# EAGLE design ICS40300-preamp-surfacemount_Rev-A (EAGLE 8.0.0)
COMPANY: ADAFRUIT INDUSTRIES; DRAWN: KTOWN; REV: A
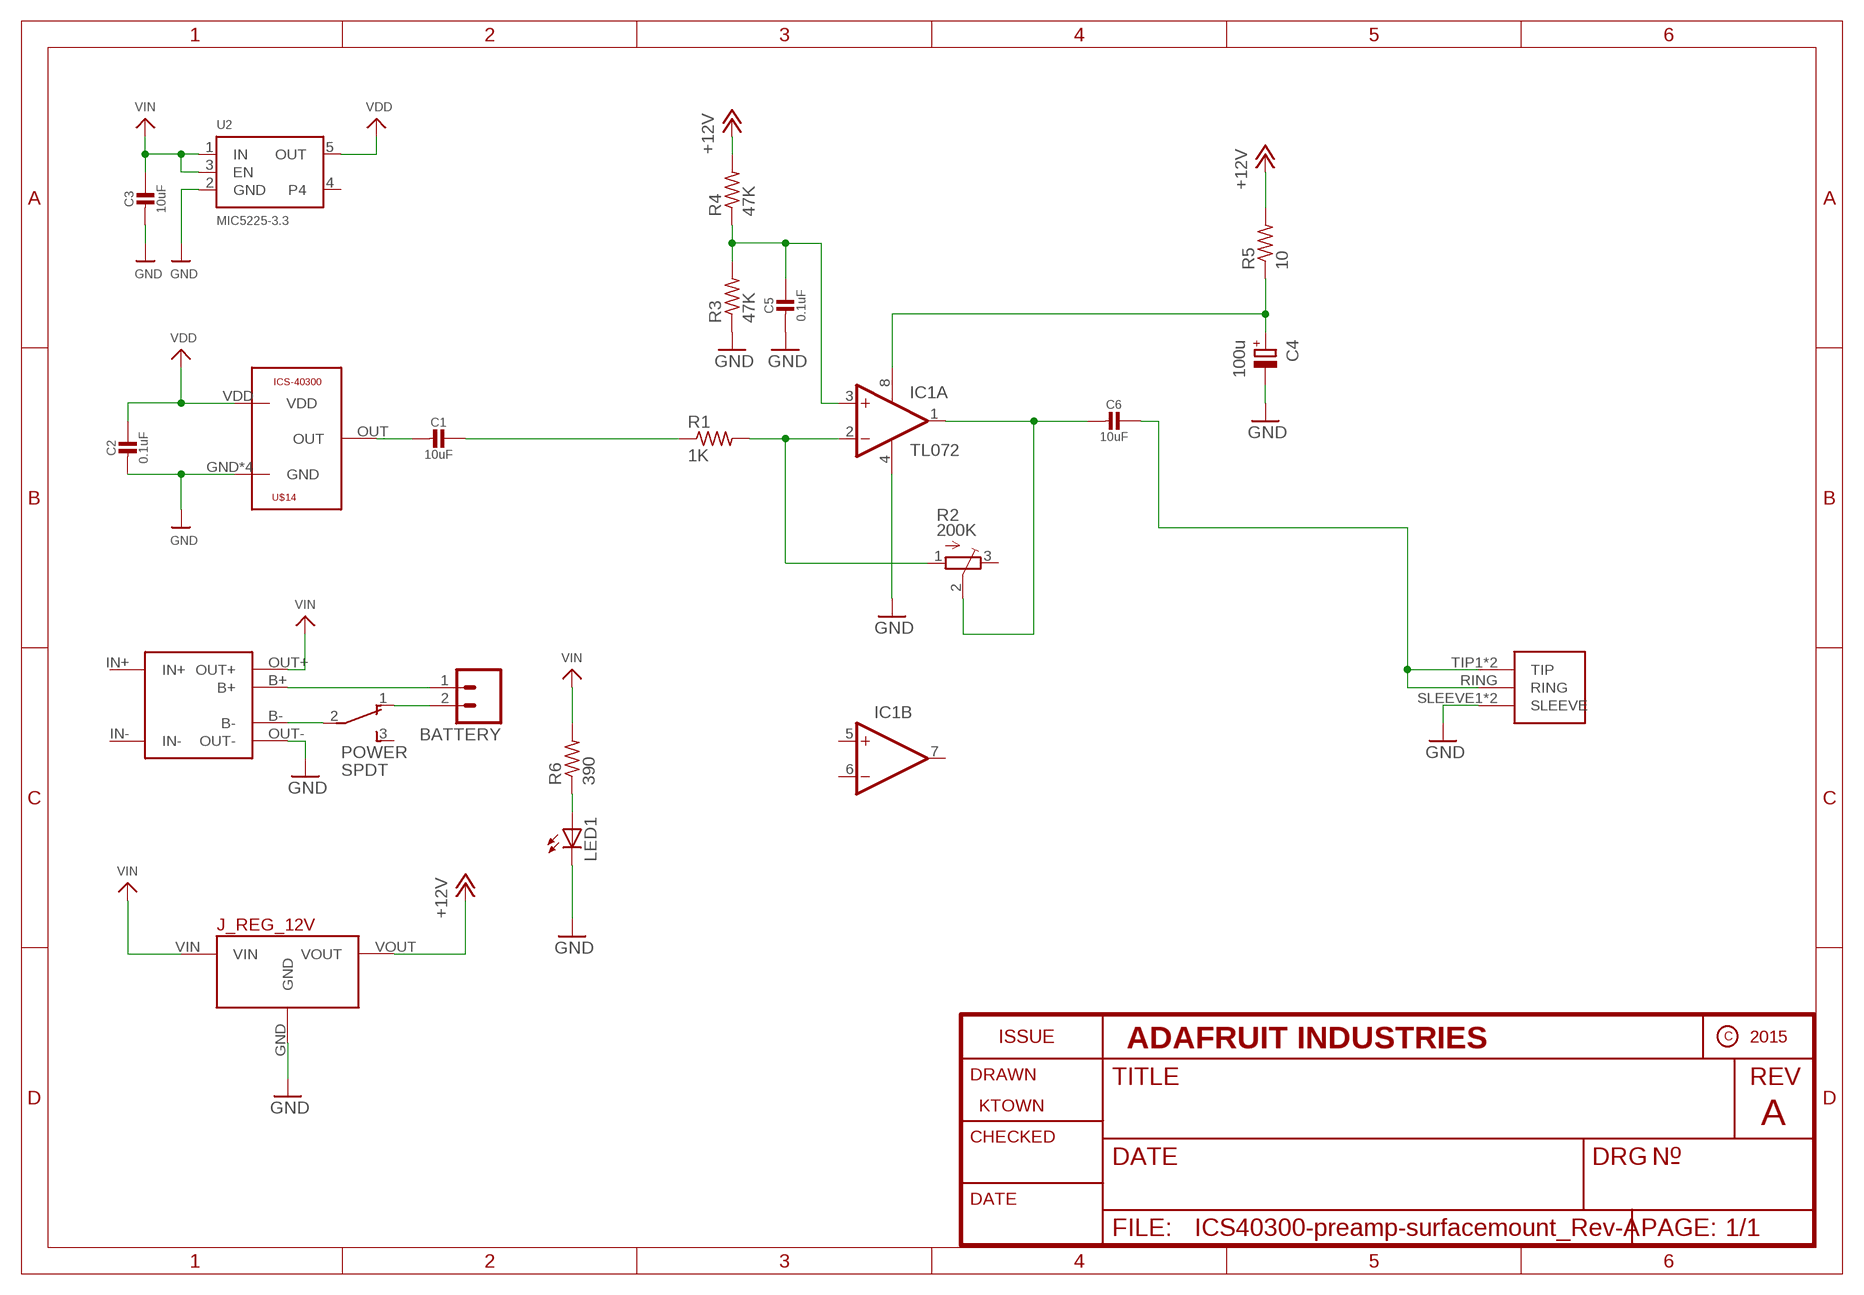
[diagram p0: schematic, sheet 1]

## Parts
BATTERY  M02LOCK  [1X02_LOCK]
C1  10uF  CAP_CERAMIC0805-NOOUTLINE  [0805-NO]
C2  0.1uF  CAP_CERAMIC0805-NOOUTLINE  [0805-NO]
C3  10uF  CAP_CERAMIC0805-NOOUTLINE  [0805-NO]
C4  100u  CPOL-EUTT2D4L  [TT2D4L]
C5  0.1uF  CAP_CERAMIC0805-NOOUTLINE  [0805-NO]
C6  10uF  CAP_CERAMIC0805-NOOUTLINE  [0805-NO]
IC1  TL072  OPA2134UA  [SO08]
J_REG_12V  POLOLU_VOLTAGE_REGULATORS_3PIN  [POLOLU_5V-12V_STEPUP_U3V12F5-U3V12F12]
LED1  LED3MM  [LED3MM]
POWER  SPDT  SWITCH_SPDTTE-CONNECT  [SWITCH_SPDT-TE-CONNECT]
R1  1K  R-US_R0805  [R0805]
R2  200K  TRIMPOT3386  [TRIM-3386]
R3  47K  R-US_R0805  [R0805]
R4  47K  R-US_R0805  [R0805]
R5  10  R-US_R0805  [R0805]
R6  390  R-US_R0805  [R0805]
U2  MIC5225-3.3  VREG_SOT23-5  [SOT23-5]
U$13  1/8"-F-STEREO-PCB  [1/8"-F-STEREO-PCB]
U$14  ICS-40300  [ICS-40300]
USB-LIPO-CHARGER  TP4056-MODULE  [TP4056-LITHIUM-PROTECTED-MODULE]

## Nets
+12V: J_REG_12V.VOUT R4.2 R5.2
GND: C2.2 C3.2 C4.- C5.2 IC1.4(A:V-) J_REG_12V.GND LED1.K(C) R3.1 U2.2(GND) U$13.SLEEVE1(SLEEVE) U$13.SLEEVE2(SLEEVE) U$14.GND U$14.GND1(GND) U$14.GND2(GND) U$14.GND3(GND) USB-LIPO-CHARGER.OUT-
N$1: C1.2 U$14.OUT
N$2: C1.1 R1.1
N$4: C4.+ IC1.8(A:V+) R5.1
N$5: IC1.2(A:-IN) R1.2 R2.1(A)
N$7: C6.1 U$13.RING U$13.TIP1(TIP) U$13.TIP2(TIP)
N$8: C5.1 IC1.3(A:+IN) R3.2 R4.1
N$9: C6.2 IC1.1(A:OUT) R2.2(S)
N$11: BATTERY.2 POWER.1
N$16: LED1.A R6.1
N$18: BATTERY.1 USB-LIPO-CHARGER.B+
N$19: POWER.2 USB-LIPO-CHARGER.B-
VDD: C2.1 U2.5(OUT) U$14.VDD
VIN: C3.1 J_REG_12V.VIN R6.2 U2.1(IN) U2.3(EN) USB-LIPO-CHARGER.OUT+
Unconnected: IC1.5(B:+IN) IC1.6(B:-IN) IC1.7(B:OUT) POWER.3 R2.3(E) U2.4

## Power pins joined to a net without a drawn wire
IN+: USB-LIPO-CHARGER.IN+
IN-: USB-LIPO-CHARGER.IN-

## Library data of the parts
BATTERY = CMU-ArtFab:M02: Header 2 Standard 2-pin 0.1" header. Use with straight break away headers (SKU : PRT-00116), right angle break away headers (PRT-00553), swiss pins (PRT-00743), machine pins (PRT-00117), and female headers (PRT-00115). Molex polarized connector foot print use with SKU : PRT-08233 with associated crimp pins and housings.
C1-C3 C5 C6 = microbuilder:CAP_CERAMIC: Ceramic Capacitors For new designs, use the packages preceded by an '_' character since they are more reliable: The following footprints should be used on most boards: _0402 - Standard footprint for regular board layouts _0603 - Standard footprint for regular board layouts _0805 - Standard footprint for regular board layouts _1206 - Standard footprint for regular board layouts For extremely tight-pitch boards where space is at a premium, the following 'micro-pitch' footprints can be used (smaller pads, no silkscreen outline, etc.): _0402MP - Micro-pitch footprint for very dense/compact boards _0603MP - Micro-pitch footprint for very dense/compact boards _0805MP - Micro-pitch footprint for very dense/compact boards _1206MP - Micro-pitch footprint for very dense/compact boards
C4 = rcl:CPOL-EU: POLARIZED CAPACITOR, European symbol
IC1 = linear:OPA2*: Dual Operational Amplifier Low Power, Single-Supply, Rail-To-Rail Operational Amplifier Source: http://focus.ti.com/lit/ds/symlink/opa2345.pdf http://focus.ti.com .. opa241.pdf http://focus.ti.com/lit/ds/symlink/opa2134.pdf; IC_NAME: TL072
J_REG_12V = CMU-ArtFab:POLOLU_VOLTAGE_REGULATORS_3PIN: Polulu 5V Step-Up/Step-Down Voltage REgulator S7V7F5
LED1 = led:LED: LED OSRAM: - CHIPLED LG R971, LG N971, LY N971, LG Q971, LY Q971, LO R971, LY R971 LH N974, LH R974 LS Q976, LO Q976, LY Q976 LO Q996 - Hyper CHIPLED LW Q18S LB Q993, LB Q99A, LB R99A - SideLED LS A670, LO A670, LY A670, LG A670, LP A670 LB A673, LV A673, LT A673, LW A673 LH A674 LY A675 LS A676, LA A676, LO A676, LY A676, LW A676 LS A679, LY A679, LG A679 - Hyper Micro SIDELED® LS Y876, LA Y876, LO Y876, LY Y876 LT Y87S - SmartLED LW L88C, LW L88S LB L89C, LB L89S, LG L890 LS L89K, LO L89K, LY L89K LS L896, LA L896, LO L896, LY L896 - TOPLED LS T670, LO T670, LY T670, LG T670, LP T670 LSG T670, LSP T670, LSY T670, LOP T670, LYG T670 LG T671, LOG T671, LSG T671 LB T673, LV T673, LT T673, LW T673 LH T674 LS T676, LA T676, LO T676, LY T676, LB T676, LH T676, LSB T676, LW T676 LB T67C, LV T67C, LT T67C, LS T67K, LO T67K, LY T67K, LW E67C LS E67B, LA E67B, LO E67B, LY E67B, LB E67C, LV E67C, LT E67C LW T67C LS T679, LY T679, LG T679 LS T770, LO T770, LY T770, LG T770, LP T770 LB T773, LV T773, LT T773, LW T773 LH T774 LS E675, LA E675, LY E675, LS T675 LS T776, LA T776, LO T776, LY T776, LB T776 LHGB T686 LT T68C, LB T68C - Hyper Mini TOPLED® LB M676 - Mini TOPLED Santana® LG M470 LS M47K, LO M47K, LY M47K Source: http://www.osram.convergy.de LUXEON: - LUMILED® LXK2-PW12-R00, LXK2-PW12-S00, LXK2-PW14-U00, LXK2-PW14-V00 LXK2-PM12-R00, LXK2-PM12-S00, LXK2-PM14-U00 LXK2-PE12-Q00, LXK2-PE12-R00, LXK2-PE12-S00, LXK2-PE14-T00, LXK2-PE14-U00 LXK2-PB12-K00, LXK2-PB12-L00, LXK2-PB12-M00, LXK2-PB14-N00, LXK2-PB14-P00, LXK2-PB14-Q00 LXK2-PR12-L00, LXK2-PR12-M00, LXK2-PR14-Q00, LXK2-PR14-R00 LXK2-PD12-Q00, LXK2-PD12-R00, LXK2-PD12-S00 LXK2-PH12-R00, LXK2-PH12-S00 LXK2-PL12-P00, LXK2-PL12-Q00, LXK2-PL12-R00 Source: www.luxeon.com KINGBRIGHT: KA-3528ASYC Source: www.kingbright.com
POWER = CMU-ArtFab:SWITCH_SPDT
R1 R3-R6 = CMU-ArtFab:R-US_: RESISTOR, American symbol
R2 = adafruit:TRIMPOT: SMT trimmer potentiometer part number TC33X http://www.ladyada.net/library/eagle
U2 = microbuilder:VREG_SOT23-5: SOT23-5 Fixed Voltage Regulators Part Current Out V Out V In V Dropout θJA (°C/W) TJ (°C) Digikey Part No. ADP121 150mA 3.3V 3.4-5.5V 0.09V @ 150mA -- -- ADP121-AUJZ33R7CT-ND ADP121 150mA 3.0V 3.1-5.5V 0.09V @ 150mA -- -- ADP121-AUJZ30R7CT-ND ADP122 300mA 3.3V 3.4-5.5V 0.085V @ 300mA -- -- ADP122AUJZ-3.3-R7CT-ND ADP1712 300mA 3.3V 3.5-5.5V 0.17V @ 300mA -- -- ADP1712AUJZ-3.3-R7TR-ND AP7311 (Low Cost) 150mA 3.3V 3.5-6V 0.15V @ 150mA -- -- AP7311-33WG-7DICT-ND LD39015M18R 150mA 1.8V 1.9V-5.5V 0.08V @ 100mA -- -- 497-6977-1-ND LP2985A-33DBVR 150mA 3.3V 3.3-16V 0.28V @ 150mA 206 150 296-18479-1-ND MCP1824T-3302E/OT 300mA 3.3V 3.5V-6V 0.2V @ 300mA -- -- MCP1824T-3302E/OTCT-ND MIC5205-2.5YM5 TR 150mA 2.5V 2.7-16V 0.165V @ 150mA -- -- 576-1257-2-ND MIC5205-3.0YM5 TR 150mA 3.0V 3.2V-16V 0.165V @ 150mA -- -- 576-1258-2-ND MIC5205-3.3YM5 TR 150mA 3.3V 3.5V-16V 0.165V @ 150mA -- -- 576-1259-2-ND TPS780330220 150mA 3.3V+2.2V 3.6-5.5V 250mV Max -- -- 296-23332-1-ND TDA3663/N1,135 100mA 3.3V 3.5-45V 0.18V @ 50mA -- -- 568-5343-1-ND Max operating temp can be calculated using θJA, TJ (max junction temperature), and power in watts. Set the "Maximum Ambient Temperature" until it reaches TJ ("Max Junction Temperature"), which is the absolute limit for safe use of the regulator: Heat Sink Temperature Calculator <http://www.daycounter.com/Calculators/Heat-Sink-Temperature-Calculator.phtml> For example, With 12V source into a 3.3V LP2985 and a 30mA load, we are dissipating (12V-3.3V) * 0.03A = 0.261W. With a θJA of 206 °C/W, a TJ of 150°C, and 261mW we can safely use the chip without a heat sink up to 75°C (=147.1°C Junction Temperature).
U$13 = CMU-ArtFab:1/8"-F-STEREO-PCB
U$14 = CMU-ArtFab:ICS-40300
USB-LIPO-CHARGER = CMU-ArtFab:TP4056-MODULE

## Board
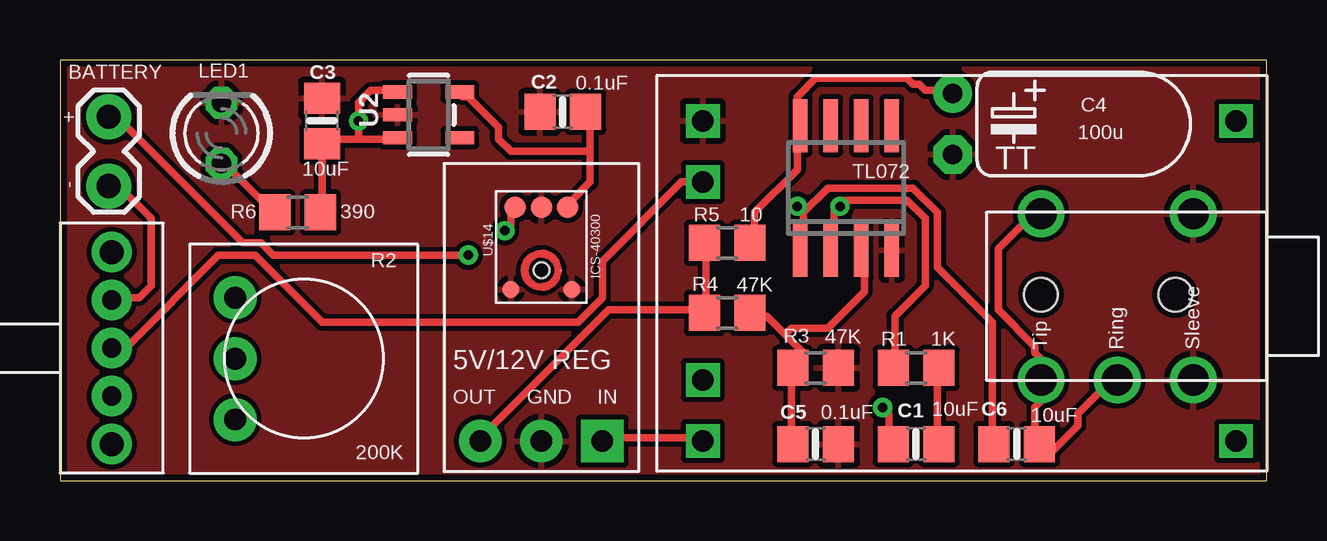
[diagram p1: board, top side]
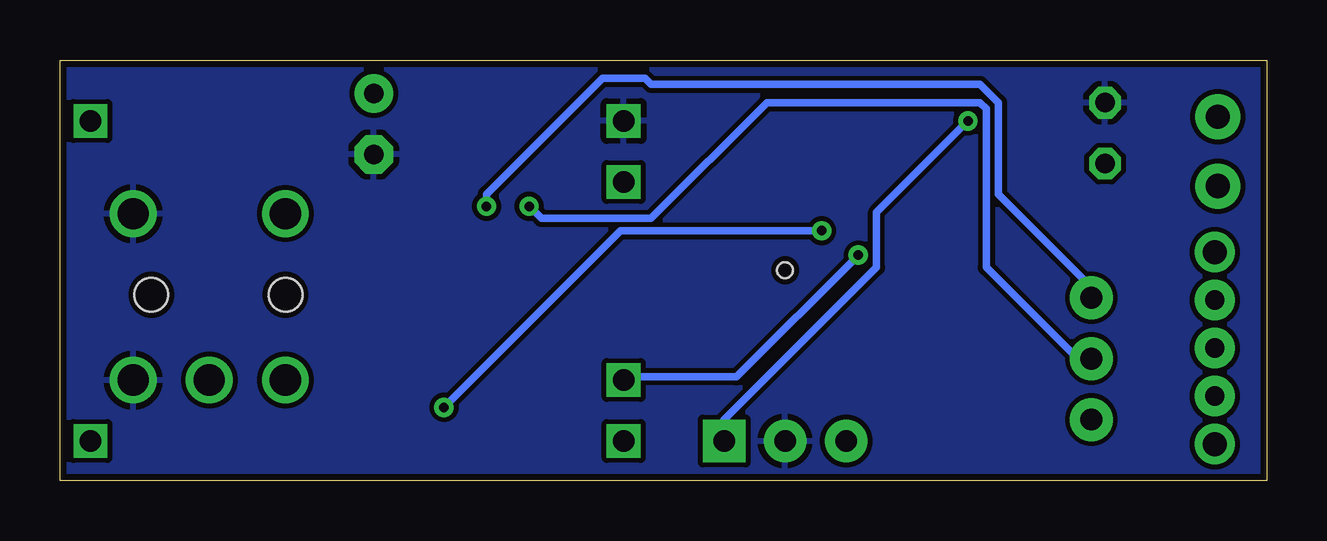
[diagram p2: board, bottom side, seen from below]

Size 50.29 x 17.53 mm. Coordinates in mm from the lower left corner, seen from the top.
Outline: 0,0 50.29,0 50.29,17.53 0,17.53 0,0
Copper layers (1*16): Top 0.035mm / dielectric 1.5mm / Bottom 0.035mm
Design rules "adafruit *": minimum track width 12mil, minimum drill 15.5mil, track to track 8mil, track to pad 8mil, pad to pad 8mil, via to via 8mil, smd to smd 8mil, copper to edge 10mil, drill to drill 8mil, minimum pad ring 10mil, minimum via ring 8mil, stop-mask expansion 2mil, vias tented up to drill 20mil, thermal gap 10mil

### Footprints (pad centres in the part's own frame; a part is rotated, then mirrored left to right if it is on the bottom)
1X02_LOCK = drill 1.016 pad 1.88: 1 -0.178,0; 2 2.718,0
0805-NO = smd 1.3 x 1.5: 1 -0.95,0; 2 0.95,0
TT2D4L = drill 0.813 pad 1.6: + -1.27,0 | drill 0.813 pad 1.6 octagon: - 1.27,0
SO08 = smd 0.6 x 2.2: 1 -1.905,-2.6; 2 -0.635,-2.6; 3 0.635,-2.6; 4 1.905,-2.6; 5 1.905,2.6; 6 0.635,2.6; 7 -0.635,2.6; 8 -1.905,2.6
POLOLU_5V-12V_STEPUP_U3V12F5-U3V12F12 = drill 0.9 pad 1.778: GND 0,-6.35; VOUT -2.54,-6.35 | drill 0.9 pad 1.778 square: VIN 2.54,-6.35
LED3MM = drill 0.813 octagon: A -1.27,0; K 1.27,0
SWITCH_SPDT-TE-CONNECT = drill 0.8 pad 1.676: 1 2,0; 2 4,0; 3 6,0 | drill 1 pad 1.676: MOUNT1 0,0; MOUNT2 8,0
R0805 = smd 1.3 x 1.5: 1 -0.95,0; 2 0.95,0
TRIM-3386 = drill 0.9 pad 1.778: 1 -2.54,-2.857; 2 0,-2.857; 3 2.54,-2.857
SOT23-5 = smd 0.55 x 1.2: 1 -0.95,-1.3; 2 0,-1.3; 3 0.95,-1.3; 4 0.95,1.3; 5 -0.95,1.3
1/8"-F-STEREO-PCB = drill 1.3: RING 5.461,0; SLEEVE1 8.636,6.934; SLEEVE2 8.636,0; TIP1 2.286,6.934; TIP2 2.286,0 | hole 1.4: 2.286,3.556; 7.874,3.556
ICS-40300 = smd 0.9 x 0.9: GND -2.62,0; OUT -2.62,-1.1; VDD -2.62,1.1 | smd 0.7 x 0.7: GND1 0.79,1.27; GND2 0.79,-1.27 | smd 0.1 x 0.1: GND3 0,0.82 | hole 0.65: 0,0
TP4056-LITHIUM-PROTECTED-MODULE = drill 0.9 square: B+ 10.795,4.445; B- 10.795,-3.81; IN+ -11.43,6.985; IN- -11.43,-6.35; OUT+ 10.795,6.985; OUT- 10.795,-6.35

### Placement (x,y rotation side)
BATTERY  2.03,14.99 270 top
C1  35.69,1.52 180 top
C2  20.95,15.37 180 top
C3  10.92,14.99 90 top
C4  37.21,14.86 270 top
C5  31.5,1.52 0 top
C6  39.88,1.52 180 top
IC1  32.77,12.19 0 top
J_REG_12V  20.07,8 0 top
LED1  6.73,14.48 90 top
POWER  2.16,9.53 270 top
R1  35.69,4.7 180 top
R2  10.16,5.08 270 top
R3  31.5,4.7 180 top
R4  27.81,6.99 180 top
R5  27.81,9.91 180 top
R6  9.91,11.18 0 top
U2  15.37,15.24 270 top
U$13  38.61,4.19 0 top
U$14  20.07,8.76 270 top
USB-LIPO-CHARGER  37.59,8.64 180 top

### Tracks (layer width: path | path; a pad name or v marks a point on that pad's centre or on a via)
+12V
  Top 0.305: R5.2 26.92,9.91 26.92,7.11 R4.2 26.67,7.11 22.86,7.11 17.53,1.78 J_REG_12V.VOUT
GND
  pour Top: 50.67,-0.76 50.67,18.29 -0.51,18.29 -0.51,-0.76
  pour Bottom: -0.51,-0.76 50.67,-0.76 50.67,18.29 -0.51,18.29
N$1  (via drill 0.39)
  Top 0.305: v18.54,10.41 18.8,10.67 18.8,11.18 U$14.OUT | v34.29,3.05 34.54,2.79 34.54,1.52 C1.2
  Bottom 0.305: v18.54,10.41 26.92,10.41 v34.29,3.05
N$2
  Top 0.305: C1.1 36.58,1.52 36.58,4.57 R1.1
N$4
  Top 0.305: R5.1 28.96,9.91 28.96,11.18 30.73,12.95 30.73,14.73 IC1.8 30.73,14.99 30.73,16 31.5,16.76 35.31,16.76 35.56,16.51 35.81,16.51 36.07,16.26 37.08,16.26 C4.+
N$5  (via drill 0.39)
  Top 0.305: R1.2 34.8,4.83 34.8,6.86 36.07,8.13 36.07,10.92 35.31,11.68 32.77,11.68 v32.51,11.43 32.26,11.18 32.26,9.65 IC1.2
  Bottom 0.305: v32.51,11.43 32.51,11.94 27.69,16.76 25.91,16.76 25.65,16.51 11.94,16.51 11.18,15.75 11.18,11.94 7.37,8.13 7.37,7.62 R2.1
N$7
  Top 0.305: U$13.RING 43.94,4.06 43.69,4.06 42.42,2.79 42.42,2.29 41.4,1.27 41.15,1.27 40.89,1.52 C6.1 40.64,1.52 40.64,3.05 40.89,3.3 U$13.TIP2 40.89,5.08 40.64,5.33 40.64,5.59 39.12,7.11 39.12,9.65 40.39,10.92 40.89,10.92 U$13.TIP1
N$8
  Top 0.305: C5.1 30.48,1.52 30.48,4.57 R3.2 30.73,4.83 30.99,5.08 30.99,5.33 30.23,6.1 | 30.23,6.1 29.46,6.86 28.96,6.86 R4.1 | 30.23,6.1 30.48,6.35 32,6.35 33.53,7.87 33.53,9.4 IC1.3
N$9  (via drill 0.39)
  Top 0.305: 30.99,11.18 32,12.19 35.56,12.19 36.58,11.18 36.58,8.89 38.86,6.6 38.86,1.52 C6.2 | 30.99,11.18 30.99,9.65 IC1.1 | 30.99,11.18 v30.73,11.43
  Bottom 0.305: R2.2 7.87,5.08 11.68,8.89 11.68,15.49 11.94,15.75 20.83,15.75 25.65,10.92 30.23,10.92 v30.73,11.43
N$11
  Top 0.305: POWER.1 2.29,7.62 3.3,7.62 3.81,8.13 3.81,10.92 2.54,12.19 2.03,12.19 BATTERY.2
N$16
  Top 0.305: R6.1 8.89,11.18 6.86,13.21 LED1.A
N$18  (via drill 0.39)
  Top 0.305: v17.02,9.4 8.89,9.4 8.38,9.91 7.62,9.91 2.54,14.99 2.03,14.99 BATTERY.1
  Bottom 0.305: v17.02,9.4 22.1,4.32 26.67,4.32 USB-LIPO-CHARGER.B+
N$19
  Top 0.305: USB-LIPO-CHARGER.B- 25.91,12.45 22.61,9.14 22.61,7.62 21.59,6.6 10.92,6.6 8.13,9.4 6.6,9.4 2.79,5.59 2.29,5.59 POWER.2
VDD
  Top 0.305: 22.1,13.72 22.1,15.24 C2.1 | 22.1,13.72 22.1,12.45 21.34,11.68 21.34,11.43 U$14.VDD | 22.1,13.72 18.8,13.72 18.29,14.22 18.29,14.73 17.02,16 16.76,16 U2.5
VIN  (via drill 0.39)
  Top 0.305: 12.45,14.22 10.92,14.22 C3.1 10.92,11.18 R6.2 | 12.45,14.22 13.97,14.22 U2.3 | 12.45,14.22 v12.45,14.99 12.45,15.75 12.95,16.26 13.97,16.26 U2.1 | USB-LIPO-CHARGER.OUT+ 26.67,1.78 22.61,1.78 J_REG_12V.VIN
  Bottom 0.305: v12.45,14.99 16.26,11.18 16.26,8.89 22.61,2.54 J_REG_12V.VIN

### Text on the board
tNames: + | -